# EAGLE schematic rfid_vratnik_esp8266 (EAGLE 9.0.1)
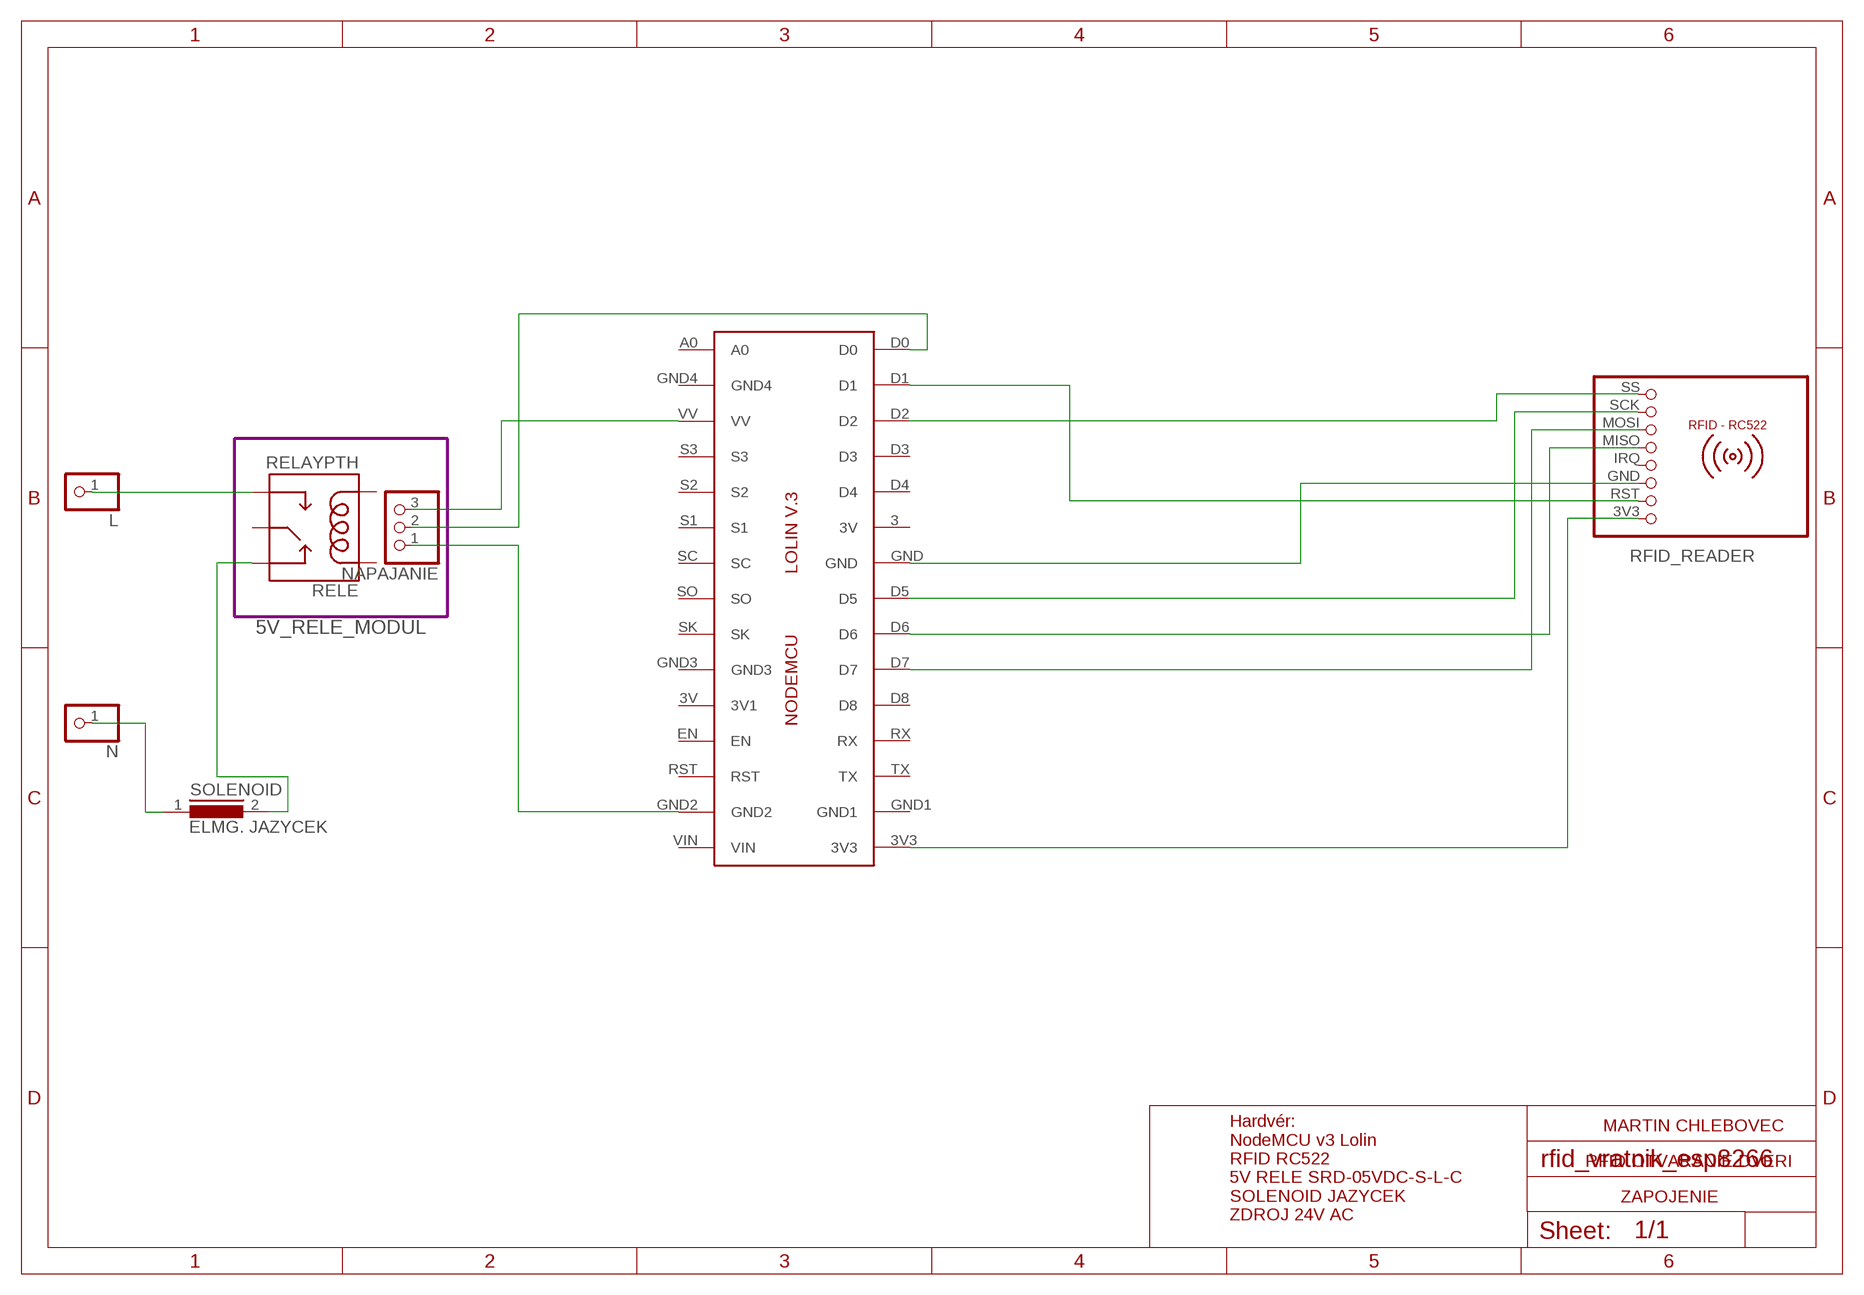
[diagram p0: schematic, sheet 1]

## Parts
IC1  LOLINV3  [LOLINV3]
L  PINHD-1X1CB  [1X01-CLEANBIG]
N  PINHD-1X1CB  [1X01-CLEANBIG]
NAPAJANIE  PINHD-1X3  [1X03]
RELE  RELAYPTH  [SRD-05VDC-SL-C]
RFID_READER  RFID-RC522  [RFID-RC522]
SOLENOID  ELMG. JAZYCEK  SLF7045  [SLF7045]

## Module instances
5V_RELE_MODUL = RELE

## Nets
N$1: IC1.3V3 RFID_READER.3V3
N$2: IC1.VV NAPAJANIE.3
N$3: IC1.GND RFID_READER.GND
N$4: IC1.D6 RFID_READER.MISO
N$5: IC1.D7 RFID_READER.MOSI
N$6: IC1.D5 RFID_READER.SCK
N$7: IC1.D2 RFID_READER.SS
N$8: IC1.D1 RFID_READER.RST
N$9: IC1.D0 NAPAJANIE.2
N$10: IC1.GND2 NAPAJANIE.1
N$11: L.1 RELE.SWOPEN
N$12: N.1 SOLENOID.1
N$13: RELE.SWCLOSED(SWCLOSE) SOLENOID.2
Unconnected: IC1.3(3V) IC1.3V(3V1) IC1.A0 IC1.D3 IC1.D4 IC1.D8 IC1.EN IC1.GND1 IC1.GND3 IC1.GND4 IC1.RST IC1.RX IC1.S1 IC1.S2 IC1.S3 IC1.SC IC1.SK IC1.SO IC1.TX IC1.VIN RELE.COIL0 RELE.COIL1 RELE.SWCOMMON RFID_READER.IRQ

## Notes on the sheet
- MARTIN CHLEBOVEC
- RFID OTVARANIE DVERI
- ZAPOJENIE
- Hardvér:
  NodeMCU v3 Lolin
  RFID RC522
  5V RELE SRD-05VDC-S-L-C
  SOLENOID JAZYCEK
  ZDROJ 24V AC

## Library data of the parts
IC1 = Lolin:LOLINV3
L N = adafruit:PINHD-1X1: Pin header 1x1 for 0.1" spacing With round pins
NAPAJANIE = pinhead:PINHD-1X3: PIN HEADER
RELE = SRD-05VDC-SL-C:RELAY: SPDT relay (COM-00101)
RFID_READER = mfrc522-module:RFID-RC522: RFID-RC522 MFRC-522 based breakout board
SOLENOID = inductors:SLF7045: SMD Inductors(Coils) For Power Line (Wound, Magnetic Shielded) Source: TDK, e531_slf7045.pdf; SPICEPREFIX: L

## Module RELE
Ports: 

### Library data of the parts